# EAGLE schematic Simple-Bug-2N918 (EAGLE 7.6.0)
Simple FM Transmitter with Electret Microphone, using 2N918, an RF NPN Transistor
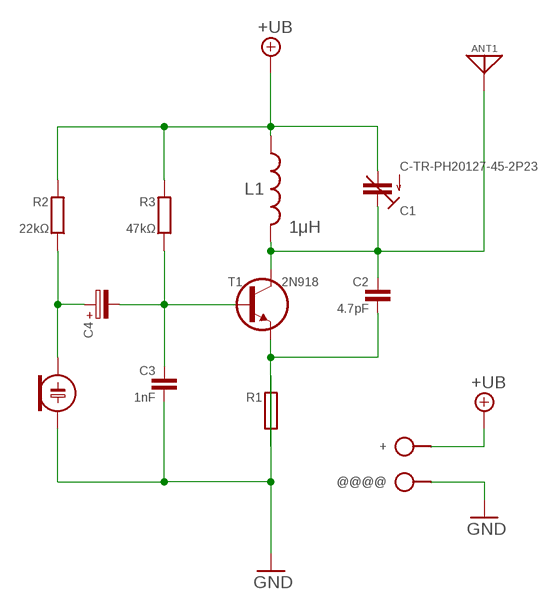
[diagram p0: schematic, sheet 1]

## Parts
+  SPAD  [SPAD]
@@@@  SPAD  [SPAD]
ANT1  ANT  [SPAD]
C1  C-TR-PH20127-45-2P23  C-TR-PH20127-45-2P21  [TRIM808-45]
C2  4.7pF  C025-020X036  [C025-020X036]
C3  1nF  C025-020X036  [C025-020X036]
C4  CPOLE2,5-3  [E2,5-3]
ECM  ECM-5  [ECM-5]
L1  1μH  L04/7  [L-04/7]
R1  R0202V  [0202V]
R2  22kΩ  R0202/5  [0202/5]
R3  47kΩ  R0202/5  [0202/5]
T1  2N918  2N918TO-72-A45  [TO72-A45]

## Nets
+UB: +.1 C1.1(A) L1.1 R2.1 R3.1
GND: @@@@.1 C3.2 ECM.1(+) R1.1
N$1: ANT1.1 C1.2(E) C2.1 L1.2 T1.3(C)
N$3: C2.2 R1.2 T1.1(E)
N$5: C3.1 C4.- R3.2 T1.2(B)
N$6: C4.+ ECM.2(-) R2.2

## Library data of the parts
+ @@@@ = pad:SPAD
ANT1 = pad:ANT
C1 = cap-trim:C-TR-PH20127
C2 C3 = c:C: CAPACITOR, European symbol
C4 = c:CPOL: POLARIZED CAPACITOR, European symbol
ECM = ECM:ECM-5
L1 = r:L
R1-R3 = r:R: RESISTOR, European symbol
T1 = t:2N918

## Net classes
0 default: width 0.813 mm